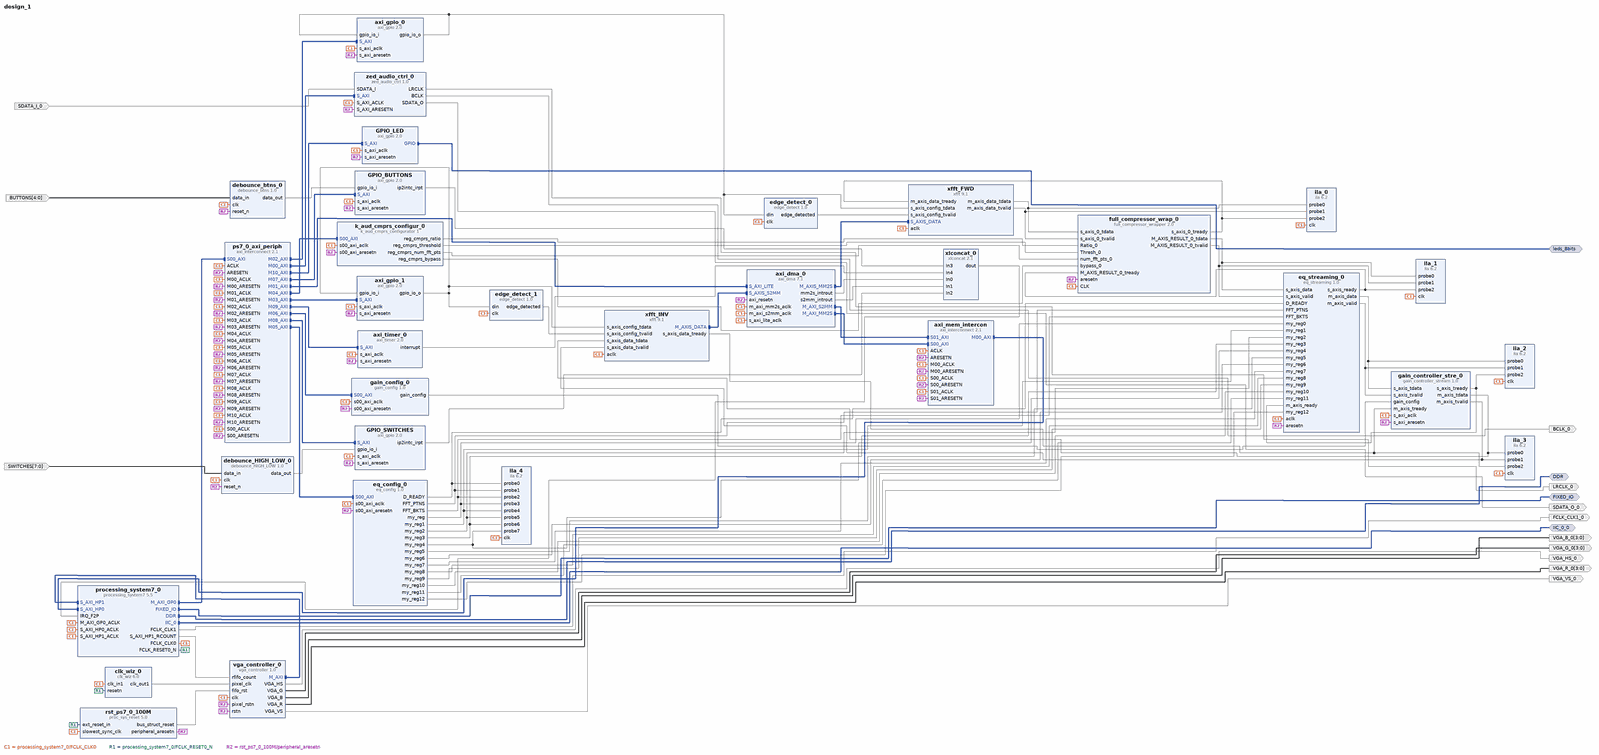
[diagram p0: block diagram of the top level, whole]
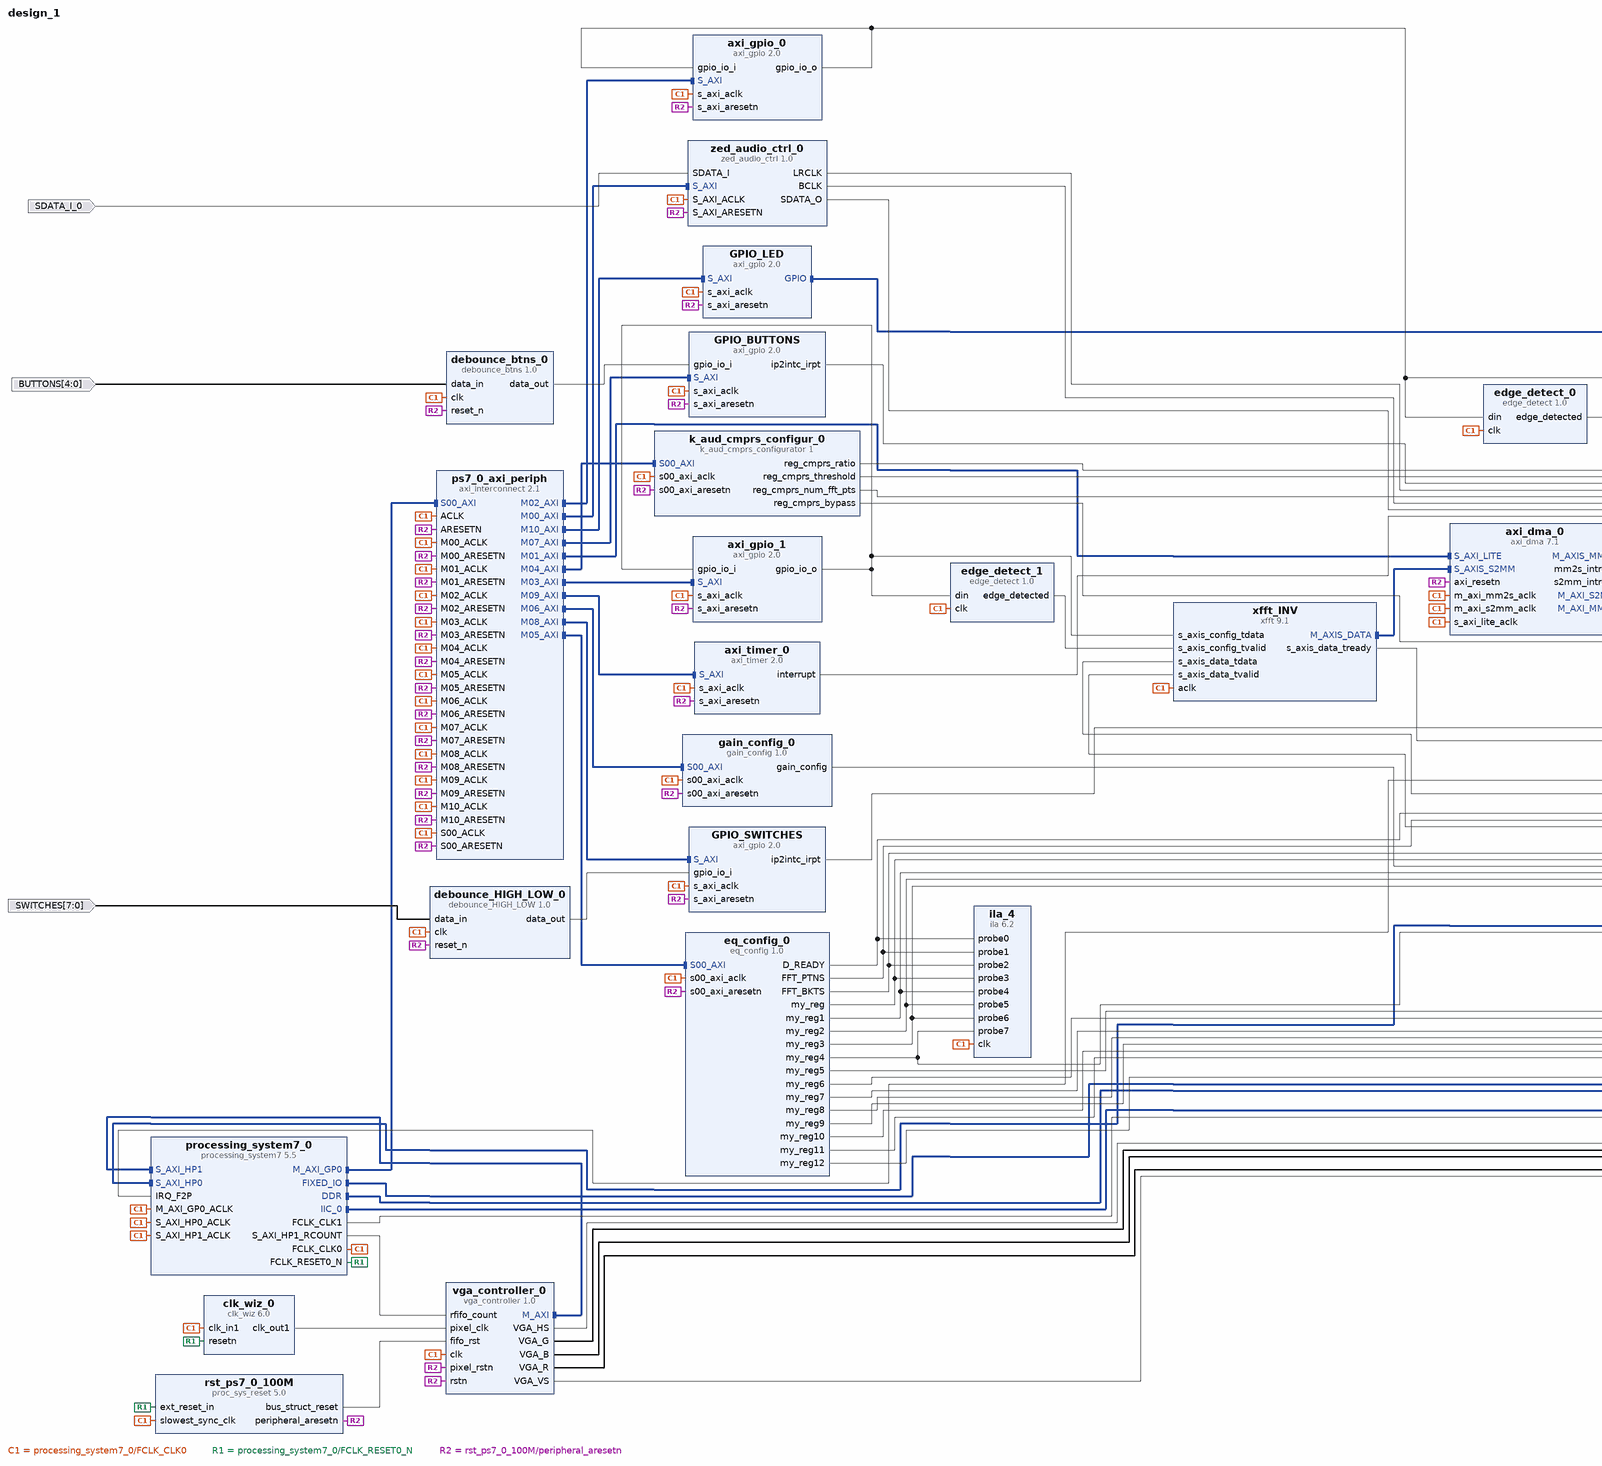
[diagram p1: block diagram of the top level, left part]
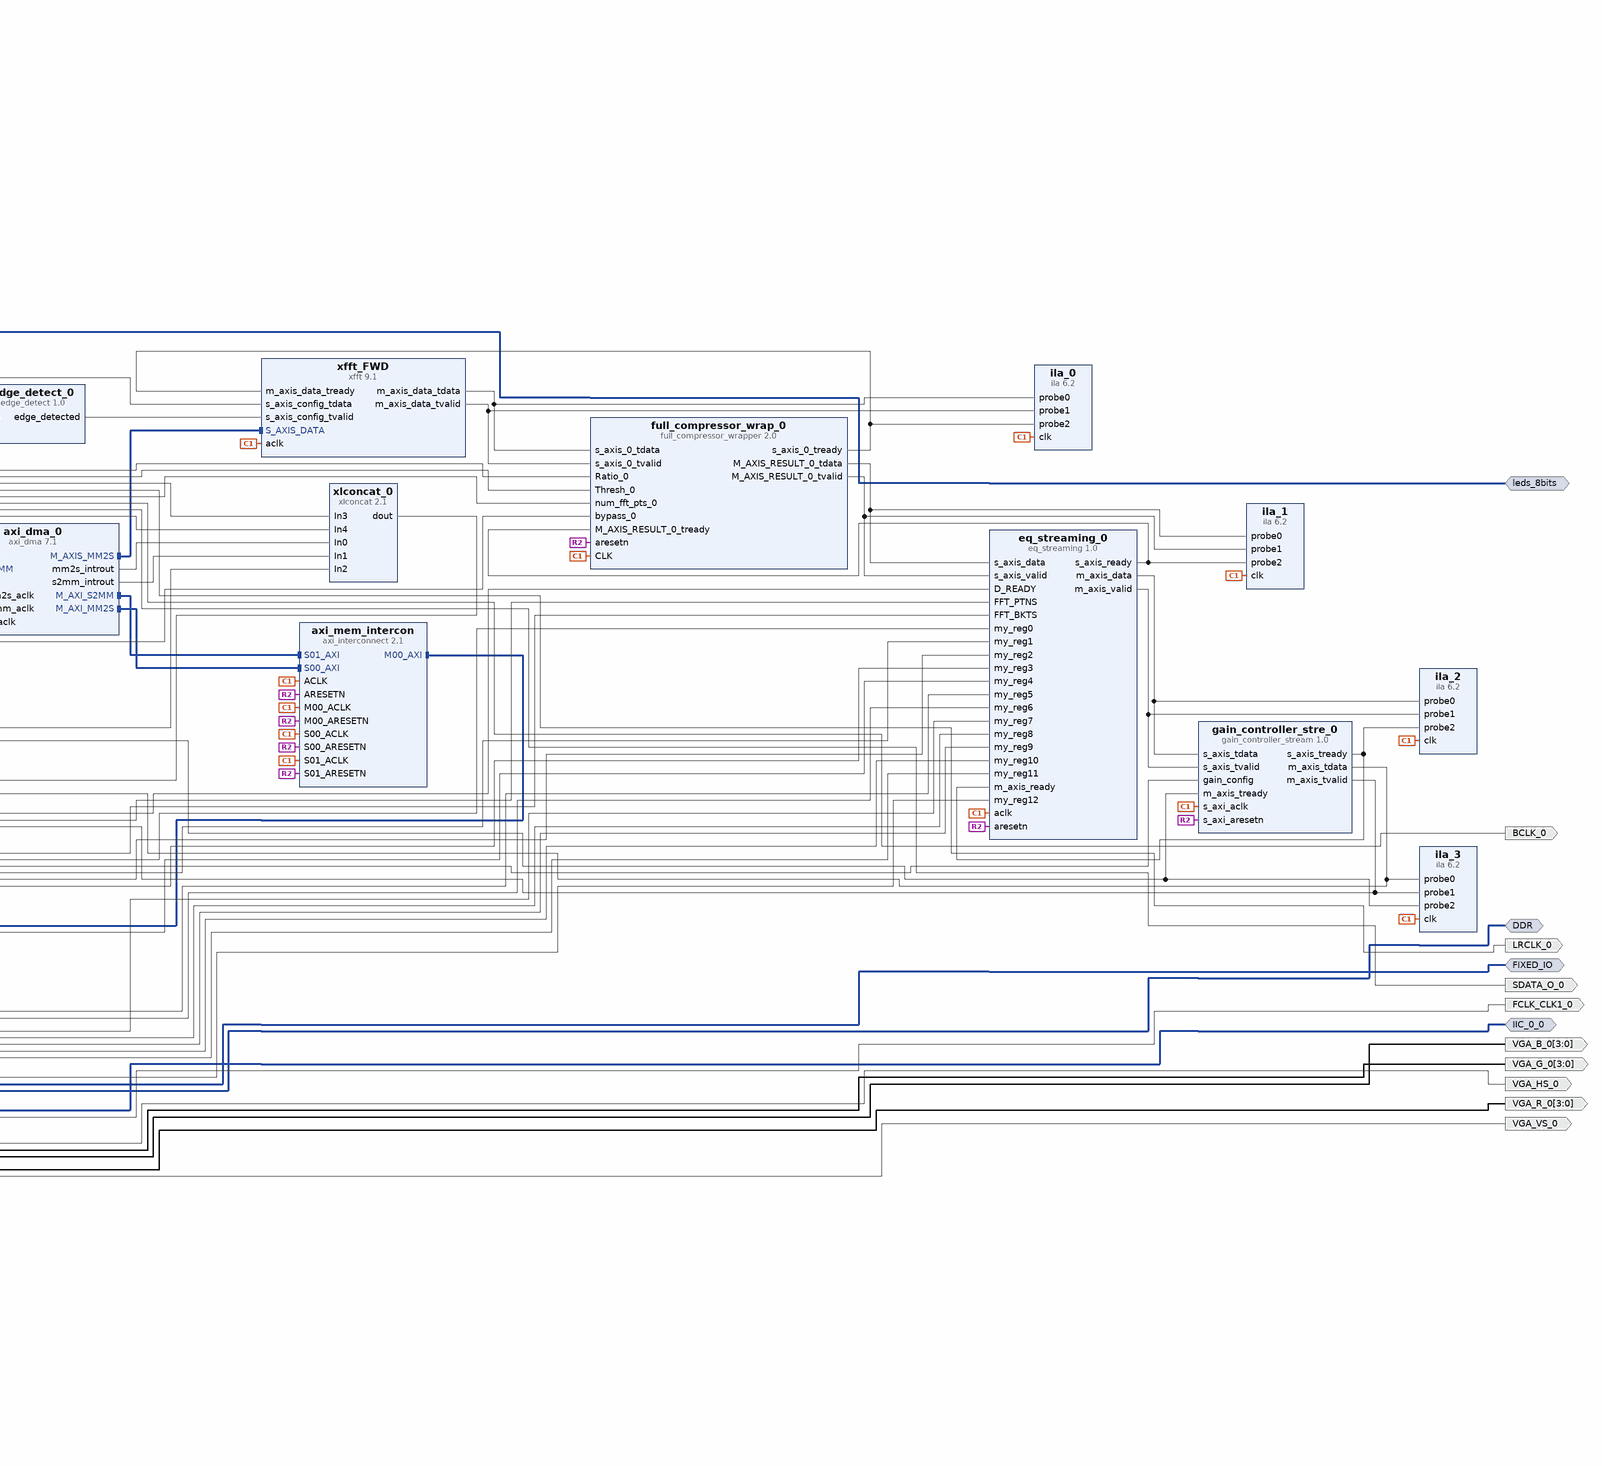
[diagram p2: block diagram of the top level, right part]
# Vivado block design design_1, xc7z020clg484-1, Vivado 2020.2
create_bd_design design_1

create_bd_intf_port -mode Master -vlnv xilinx.com:interface:ddrx_rtl:1.0 DDR
create_bd_intf_port -mode Master -vlnv xilinx.com:display_processing_system7:fixedio_rtl:1.0 FIXED_IO
create_bd_intf_port -mode Master -vlnv xilinx.com:interface:iic_rtl:1.0 IIC_0_0
create_bd_intf_port -mode Master -vlnv xilinx.com:interface:gpio_rtl:1.0 leds_8bits
create_bd_port -dir O -type clk FCLK_CLK1_0
set_property -dict {CONFIG.FREQ_HZ 10000000} [get_bd_ports FCLK_CLK1_0]
create_bd_port -dir O LRCLK_0
create_bd_port -dir O BCLK_0
create_bd_port -dir O SDATA_O_0
create_bd_port -dir I SDATA_I_0
create_bd_port -dir I -from 7 -to 0 SWITCHES
create_bd_port -dir I -from 4 -to 0 BUTTONS
create_bd_port -dir O VGA_HS_0
create_bd_port -dir O -from 3 -to 0 VGA_G_0
create_bd_port -dir O -from 3 -to 0 VGA_B_0
create_bd_port -dir O -from 3 -to 0 VGA_R_0
create_bd_port -dir O VGA_VS_0

create_bd_cell -type ip -vlnv xilinx.com:ip:processing_system7:5.5 processing_system7_0
set_property -dict [list \
  CONFIG.PCW_APU_PERIPHERAL_FREQMHZ 200 \
  CONFIG.PCW_ENET0_ENET0_IO {MIO 16 .. 27} \
  CONFIG.PCW_ENET0_GRP_MDIO_ENABLE 1 \
  CONFIG.PCW_ENET0_GRP_MDIO_IO {MIO 52 .. 53} \
  CONFIG.PCW_ENET0_PERIPHERAL_ENABLE 1 \
  CONFIG.PCW_ENET0_RESET_ENABLE 0 \
  CONFIG.PCW_ENET_RESET_ENABLE 1 \
  CONFIG.PCW_ENET_RESET_SELECT {Share reset pin} \
  CONFIG.PCW_EN_CLK1_PORT 1 \
  CONFIG.PCW_FCLK_CLK1_BUF TRUE \
  CONFIG.PCW_FPGA0_PERIPHERAL_FREQMHZ 100.000000 \
  CONFIG.PCW_FPGA1_PERIPHERAL_FREQMHZ 10 \
  CONFIG.PCW_FPGA2_PERIPHERAL_FREQMHZ 100 \
  CONFIG.PCW_FPGA_FCLK1_ENABLE 1 \
  CONFIG.PCW_GPIO_MIO_GPIO_ENABLE 1 \
  CONFIG.PCW_GPIO_MIO_GPIO_IO MIO \
  CONFIG.PCW_I2C0_I2C0_IO EMIO \
  CONFIG.PCW_I2C0_PERIPHERAL_ENABLE 1 \
  CONFIG.PCW_I2C_PERIPHERAL_FREQMHZ 33.333332 \
  CONFIG.PCW_I2C_RESET_ENABLE 1 \
  CONFIG.PCW_I2C_RESET_SELECT {Share reset pin} \
  CONFIG.PCW_IRQ_F2P_INTR 1 \
  CONFIG.PCW_PERIPHERAL_BOARD_PRESET part0 \
  CONFIG.PCW_PRESET_BANK1_VOLTAGE {LVCMOS 1.8V} \
  CONFIG.PCW_QSPI_GRP_SINGLE_SS_ENABLE 1 \
  CONFIG.PCW_QSPI_GRP_SINGLE_SS_IO {MIO 1 .. 6} \
  CONFIG.PCW_QSPI_PERIPHERAL_ENABLE 1 \
  CONFIG.PCW_QSPI_QSPI_IO {MIO 1 .. 6} \
  CONFIG.PCW_SD0_GRP_CD_ENABLE 1 \
  CONFIG.PCW_SD0_GRP_CD_IO {MIO 47} \
  CONFIG.PCW_SD0_GRP_WP_ENABLE 1 \
  CONFIG.PCW_SD0_GRP_WP_IO {MIO 46} \
  CONFIG.PCW_SD0_PERIPHERAL_ENABLE 1 \
  CONFIG.PCW_SD0_SD0_IO {MIO 40 .. 45} \
  CONFIG.PCW_SDIO_PERIPHERAL_FREQMHZ 50 \
  CONFIG.PCW_SINGLE_QSPI_DATA_MODE x4 \
  CONFIG.PCW_TTC0_PERIPHERAL_ENABLE 1 \
  CONFIG.PCW_TTC0_TTC0_IO EMIO \
  CONFIG.PCW_UART1_PERIPHERAL_ENABLE 1 \
  CONFIG.PCW_UART1_UART1_IO {MIO 48 .. 49} \
  CONFIG.PCW_UART_PERIPHERAL_FREQMHZ 50 \
  CONFIG.PCW_UIPARAM_DDR_FREQ_MHZ 533.333313 \
  CONFIG.PCW_UIPARAM_DDR_PARTNO {MT41J128M16 HA-15E} \
  CONFIG.PCW_USB0_PERIPHERAL_ENABLE 1 \
  CONFIG.PCW_USB0_RESET_ENABLE 0 \
  CONFIG.PCW_USB0_USB0_IO {MIO 28 .. 39} \
  CONFIG.PCW_USB_RESET_ENABLE 1 \
  CONFIG.PCW_USB_RESET_SELECT {Share reset pin} \
  CONFIG.PCW_USE_FABRIC_INTERRUPT 1 \
  CONFIG.PCW_USE_S_AXI_HP0 1 \
  CONFIG.PCW_USE_S_AXI_HP1 1 \
  CONFIG.preset ZedBoard \
] [get_bd_cells processing_system7_0]
# 515 more settings of processing_system7_0 are not shown: defaults, MIO pin electricals, DDR timing, and values the tool derives
create_bd_cell -type ip -vlnv xilinx.com:user:zed_audio_ctrl:1.0 zed_audio_ctrl_0
create_bd_cell -type ip -vlnv xilinx.com:ip:axi_interconnect:2.1 ps7_0_axi_periph
set_property -dict {CONFIG.NUM_MI 11 CONFIG.NUM_SI 1} [get_bd_cells ps7_0_axi_periph]
create_bd_cell -type ip -vlnv xilinx.com:ip:proc_sys_reset:5.0 rst_ps7_0_100M
create_bd_cell -type ip -vlnv xilinx.com:ip:xfft:9.1 xfft_FWD
set_property -dict [list \
  CONFIG.data_format fixed_point \
  CONFIG.implementation_options pipelined_streaming_io \
  CONFIG.input_width 16 \
  CONFIG.number_of_stages_using_block_ram_for_data_and_phase_factors 4 \
  CONFIG.output_ordering natural_order \
  CONFIG.run_time_configurable_transform_length true \
  CONFIG.target_clock_frequency 100 \
  CONFIG.transform_length 2048 \
] [get_bd_cells xfft_FWD]
create_bd_cell -type ip -vlnv xilinx.com:ip:xfft:9.1 xfft_INV
set_property -dict [list \
  CONFIG.data_format fixed_point \
  CONFIG.implementation_options pipelined_streaming_io \
  CONFIG.input_width 16 \
  CONFIG.number_of_stages_using_block_ram_for_data_and_phase_factors 4 \
  CONFIG.output_ordering natural_order \
  CONFIG.run_time_configurable_transform_length true \
  CONFIG.target_clock_frequency 100 \
  CONFIG.transform_length 2048 \
] [get_bd_cells xfft_INV]
create_bd_cell -type ip -vlnv xilinx.com:ip:axi_dma:7.1 axi_dma_0
set_property -dict [list \
  CONFIG.c_include_mm2s_dre 1 \
  CONFIG.c_include_s2mm_dre 1 \
  CONFIG.c_include_sg 0 \
  CONFIG.c_m_axi_mm2s_data_width 64 \
  CONFIG.c_m_axi_s2mm_data_width 64 \
  CONFIG.c_mm2s_burst_size 8 \
  CONFIG.c_s_axis_s2mm_tdata_width 32 \
  CONFIG.c_sg_length_width 26 \
] [get_bd_cells axi_dma_0]
create_bd_cell -type ip -vlnv xilinx.com:ip:axi_interconnect:2.1 axi_mem_intercon
set_property -dict {CONFIG.NUM_MI 1 CONFIG.NUM_SI 2} [get_bd_cells axi_mem_intercon]
create_bd_cell -type ip -vlnv xilinx.com:user:edge_detect:1.0 edge_detect_0
set_property -dict {CONFIG.N 24} [get_bd_cells edge_detect_0]
create_bd_cell -type ip -vlnv xilinx.com:ip:axi_gpio:2.0 axi_gpio_0
set_property -dict {CONFIG.C_GPIO_WIDTH 24} [get_bd_cells axi_gpio_0]
create_bd_cell -type ip -vlnv xilinx.com:user:edge_detect:1.0 edge_detect_1
set_property -dict {CONFIG.N 24} [get_bd_cells edge_detect_1]
create_bd_cell -type ip -vlnv xilinx.com:ip:axi_gpio:2.0 axi_gpio_1
set_property -dict {CONFIG.C_GPIO_WIDTH 24} [get_bd_cells axi_gpio_1]
create_bd_cell -type ip -vlnv xilinx.com:ip:xlconcat:2.1 xlconcat_0
set_property -dict {CONFIG.NUM_PORTS 5} [get_bd_cells xlconcat_0]
create_bd_cell -type ip -vlnv sfu.ca:user:eq_config:1.0 eq_config_0
create_bd_cell -type ip -vlnv sfu.ca:user:gain_config:1.0 gain_config_0
create_bd_cell -type ip -vlnv xilinx.com:ip:ila:6.2 ila_0
set_property -dict [list \
  CONFIG.C_DATA_DEPTH 8192 \
  CONFIG.C_ENABLE_ILA_AXI_MON false \
  CONFIG.C_MONITOR_TYPE Native \
  CONFIG.C_NUM_OF_PROBES 3 \
  CONFIG.C_PROBE0_WIDTH 32 \
] [get_bd_cells ila_0]
create_bd_cell -type ip -vlnv xilinx.com:ip:ila:6.2 ila_1
set_property -dict [list \
  CONFIG.C_DATA_DEPTH 8192 \
  CONFIG.C_ENABLE_ILA_AXI_MON false \
  CONFIG.C_MONITOR_TYPE Native \
  CONFIG.C_NUM_OF_PROBES 3 \
  CONFIG.C_PROBE0_WIDTH 32 \
] [get_bd_cells ila_1]
create_bd_cell -type ip -vlnv xilinx.com:ip:ila:6.2 ila_2
set_property -dict [list \
  CONFIG.C_DATA_DEPTH 8192 \
  CONFIG.C_ENABLE_ILA_AXI_MON false \
  CONFIG.C_MONITOR_TYPE Native \
  CONFIG.C_NUM_OF_PROBES 3 \
  CONFIG.C_PROBE0_WIDTH 32 \
] [get_bd_cells ila_2]
create_bd_cell -type ip -vlnv xilinx.com:ip:ila:6.2 ila_3
set_property -dict [list \
  CONFIG.C_DATA_DEPTH 8192 \
  CONFIG.C_ENABLE_ILA_AXI_MON false \
  CONFIG.C_MONITOR_TYPE Native \
  CONFIG.C_NUM_OF_PROBES 3 \
  CONFIG.C_PROBE0_WIDTH 32 \
] [get_bd_cells ila_3]
create_bd_cell -type ip -vlnv xilinx.com:ip:ila:6.2 ila_4
set_property -dict [list \
  CONFIG.C_DATA_DEPTH 8192 \
  CONFIG.C_ENABLE_ILA_AXI_MON false \
  CONFIG.C_MONITOR_TYPE Native \
  CONFIG.C_NUM_OF_PROBES 8 \
  CONFIG.C_PROBE0_WIDTH 32 \
  CONFIG.C_PROBE1_WIDTH 32 \
  CONFIG.C_PROBE2_WIDTH 32 \
  CONFIG.C_PROBE3_WIDTH 32 \
  CONFIG.C_PROBE4_WIDTH 32 \
  CONFIG.C_PROBE5_WIDTH 32 \
  CONFIG.C_PROBE6_WIDTH 32 \
  CONFIG.C_PROBE7_WIDTH 32 \
] [get_bd_cells ila_4]
create_bd_cell -type ip -vlnv xilinx.com:ip:axi_gpio:2.0 GPIO_BUTTONS
set_property -dict {CONFIG.C_ALL_INPUTS 1 CONFIG.C_GPIO_WIDTH 5 CONFIG.C_INTERRUPT_PRESENT 1} [get_bd_cells GPIO_BUTTONS]
create_bd_cell -type ip -vlnv xilinx.com:ip:axi_gpio:2.0 GPIO_SWITCHES
set_property -dict {CONFIG.C_ALL_INPUTS 1 CONFIG.C_GPIO_WIDTH 8 CONFIG.C_INTERRUPT_PRESENT 1} [get_bd_cells GPIO_SWITCHES]
create_bd_cell -type ip -vlnv sfu.ca:user:debounce_HIGH_LOW:1.0 debounce_HIGH_LOW_0
create_bd_cell -type ip -vlnv sfu.ca:user:debounce_btns:1.0 debounce_btns_0
create_bd_cell -type ip -vlnv xilinx.com:ip:axi_timer:2.0 axi_timer_0
set_property -dict {CONFIG.enable_timer2 0 CONFIG.mode_64bit 0} [get_bd_cells axi_timer_0]
create_bd_cell -type ip -vlnv user.org:user:vga_controller:1.0 vga_controller_0
set_property -dict [list \
  CONFIG.h_back_porch 88 \
  CONFIG.h_front_porch 40 \
  CONFIG.h_sync_polarity {"1"} \
  CONFIG.h_sync_pulse 128 \
  CONFIG.horizontal_length 800 \
  CONFIG.image_buffer1_baseaddr 0x10880000 \
  CONFIG.v_back_porch 23 \
  CONFIG.v_front_porch 1 \
  CONFIG.v_sync_polarity {"1"} \
  CONFIG.v_sync_pulse 4 \
  CONFIG.vertical_length 600 \
] [get_bd_cells vga_controller_0]
create_bd_cell -type ip -vlnv xilinx.com:ip:clk_wiz:6.0 clk_wiz_0
set_property -dict [list \
  CONFIG.CLKOUT1_JITTER 159.371 \
  CONFIG.CLKOUT1_REQUESTED_OUT_FREQ 40 \
  CONFIG.MMCM_CLKOUT0_DIVIDE_F 25.000 \
  CONFIG.RESET_PORT resetn \
  CONFIG.RESET_TYPE ACTIVE_LOW \
] [get_bd_cells clk_wiz_0]
create_bd_cell -type ip -vlnv xilinx.com:ip:axi_gpio:2.0 GPIO_LED
set_property -dict [list \
  CONFIG.C_DOUT_DEFAULT 0x000000a5 \
  CONFIG.GPIO_BOARD_INTERFACE leds_8bits \
  CONFIG.USE_BOARD_FLOW true \
] [get_bd_cells GPIO_LED]
create_bd_cell -type ip -vlnv sfu.ca:user:k_aud_cmprs_configurator:1 k_aud_cmprs_configur_0
create_bd_cell -type ip -vlnv sfu.ca:user:eq_streaming:1.0 eq_streaming_0
create_bd_cell -type ip -vlnv sfu.ca:user:full_compressor_wrapper:2.0 full_compressor_wrap_0
create_bd_cell -type ip -vlnv sfu.ca:user:gain_controller_stream:1.0 gain_controller_stre_0

# ---- connections ----

connect_bd_intf_net [get_bd_intf_pins ps7_0_axi_periph/M10_AXI] [get_bd_intf_pins GPIO_LED/S_AXI]
connect_bd_intf_net [get_bd_intf_pins ps7_0_axi_periph/M06_AXI] [get_bd_intf_pins gain_config_0/S00_AXI]
connect_bd_intf_net -intf_net axi_gpio_2_GPIO [get_bd_intf_ports leds_8bits] [get_bd_intf_pins GPIO_LED/GPIO]
connect_bd_intf_net [get_bd_intf_pins ps7_0_axi_periph/M08_AXI] [get_bd_intf_pins GPIO_SWITCHES/S_AXI]
connect_bd_intf_net [get_bd_intf_ports FIXED_IO] [get_bd_intf_pins processing_system7_0/FIXED_IO]
connect_bd_intf_net [get_bd_intf_pins ps7_0_axi_periph/M00_AXI] [get_bd_intf_pins zed_audio_ctrl_0/S_AXI]
connect_bd_intf_net [get_bd_intf_ports DDR] [get_bd_intf_pins processing_system7_0/DDR]
connect_bd_intf_net [get_bd_intf_pins ps7_0_axi_periph/M07_AXI] [get_bd_intf_pins GPIO_BUTTONS/S_AXI]
connect_bd_intf_net [get_bd_intf_pins ps7_0_axi_periph/M01_AXI] [get_bd_intf_pins axi_dma_0/S_AXI_LITE]
connect_bd_intf_net [get_bd_intf_pins ps7_0_axi_periph/M09_AXI] [get_bd_intf_pins axi_timer_0/S_AXI]
connect_bd_intf_net [get_bd_intf_pins processing_system7_0/S_AXI_HP1] [get_bd_intf_pins vga_controller_0/M_AXI]
connect_bd_intf_net [get_bd_intf_pins axi_dma_0/M_AXI_S2MM] [get_bd_intf_pins axi_mem_intercon/S01_AXI]
connect_bd_intf_net [get_bd_intf_pins axi_gpio_0/S_AXI] [get_bd_intf_pins ps7_0_axi_periph/M02_AXI]
connect_bd_intf_net [get_bd_intf_pins xfft_INV/M_AXIS_DATA] [get_bd_intf_pins axi_dma_0/S_AXIS_S2MM]
connect_bd_intf_net [get_bd_intf_pins axi_mem_intercon/M00_AXI] [get_bd_intf_pins processing_system7_0/S_AXI_HP0]
connect_bd_intf_net [get_bd_intf_pins processing_system7_0/M_AXI_GP0] [get_bd_intf_pins ps7_0_axi_periph/S00_AXI]
connect_bd_intf_net [get_bd_intf_pins ps7_0_axi_periph/M05_AXI] [get_bd_intf_pins eq_config_0/S00_AXI]
connect_bd_intf_net [get_bd_intf_pins axi_dma_0/M_AXIS_MM2S] [get_bd_intf_pins xfft_FWD/S_AXIS_DATA]
connect_bd_intf_net [get_bd_intf_ports IIC_0_0] [get_bd_intf_pins processing_system7_0/IIC_0]
connect_bd_intf_net [get_bd_intf_pins axi_gpio_1/S_AXI] [get_bd_intf_pins ps7_0_axi_periph/M03_AXI]
connect_bd_intf_net [get_bd_intf_pins ps7_0_axi_periph/M04_AXI] [get_bd_intf_pins k_aud_cmprs_configur_0/S00_AXI]
connect_bd_intf_net [get_bd_intf_pins axi_dma_0/M_AXI_MM2S] [get_bd_intf_pins axi_mem_intercon/S00_AXI]
connect_bd_net [get_bd_pins processing_system7_0/FCLK_CLK0] \
  [get_bd_pins processing_system7_0/M_AXI_GP0_ACLK] [get_bd_pins ps7_0_axi_periph/S00_ACLK] \
  [get_bd_pins rst_ps7_0_100M/slowest_sync_clk] [get_bd_pins ps7_0_axi_periph/M00_ACLK] [get_bd_pins ps7_0_axi_periph/ACLK] \
  [get_bd_pins axi_dma_0/s_axi_lite_aclk] [get_bd_pins ps7_0_axi_periph/M01_ACLK] [get_bd_pins axi_dma_0/m_axi_mm2s_aclk] \
  [get_bd_pins axi_mem_intercon/S00_ACLK] [get_bd_pins processing_system7_0/S_AXI_HP0_ACLK] \
  [get_bd_pins axi_mem_intercon/M00_ACLK] [get_bd_pins axi_mem_intercon/ACLK] [get_bd_pins axi_dma_0/m_axi_s2mm_aclk] \
  [get_bd_pins axi_mem_intercon/S01_ACLK] [get_bd_pins xfft_INV/aclk] [get_bd_pins xfft_FWD/aclk] \
  [get_bd_pins edge_detect_0/clk] [get_bd_pins edge_detect_1/clk] [get_bd_pins axi_gpio_0/s_axi_aclk] \
  [get_bd_pins axi_gpio_1/s_axi_aclk] [get_bd_pins ps7_0_axi_periph/M02_ACLK] [get_bd_pins ps7_0_axi_periph/M03_ACLK] \
  [get_bd_pins zed_audio_ctrl_0/S_AXI_ACLK] [get_bd_pins ps7_0_axi_periph/M04_ACLK] [get_bd_pins eq_config_0/s00_axi_aclk] \
  [get_bd_pins ps7_0_axi_periph/M05_ACLK] [get_bd_pins gain_config_0/s00_axi_aclk] [get_bd_pins ps7_0_axi_periph/M06_ACLK] \
  [get_bd_pins ila_0/clk] [get_bd_pins ila_1/clk] [get_bd_pins ila_2/clk] [get_bd_pins ila_3/clk] [get_bd_pins ila_4/clk] \
  [get_bd_pins debounce_btns_0/clk] [get_bd_pins debounce_HIGH_LOW_0/clk] [get_bd_pins GPIO_SWITCHES/s_axi_aclk] \
  [get_bd_pins GPIO_BUTTONS/s_axi_aclk] [get_bd_pins ps7_0_axi_periph/M07_ACLK] [get_bd_pins ps7_0_axi_periph/M08_ACLK] \
  [get_bd_pins axi_timer_0/s_axi_aclk] [get_bd_pins ps7_0_axi_periph/M09_ACLK] [get_bd_pins vga_controller_0/clk] \
  [get_bd_pins clk_wiz_0/clk_in1] [get_bd_pins processing_system7_0/S_AXI_HP1_ACLK] [get_bd_pins GPIO_LED/s_axi_aclk] \
  [get_bd_pins ps7_0_axi_periph/M10_ACLK] [get_bd_pins k_aud_cmprs_configur_0/s00_axi_aclk] [get_bd_pins eq_streaming_0/aclk] \
  [get_bd_pins full_compressor_wrap_0/CLK] [get_bd_pins gain_controller_stre_0/s_axi_aclk]
connect_bd_net [get_bd_pins processing_system7_0/FCLK_RESET0_N] [get_bd_pins rst_ps7_0_100M/ext_reset_in] [get_bd_pins clk_wiz_0/resetn]
connect_bd_net [get_bd_pins rst_ps7_0_100M/peripheral_aresetn] \
  [get_bd_pins ps7_0_axi_periph/S00_ARESETN] [get_bd_pins zed_audio_ctrl_0/S_AXI_ARESETN] \
  [get_bd_pins ps7_0_axi_periph/M00_ARESETN] [get_bd_pins ps7_0_axi_periph/ARESETN] [get_bd_pins axi_dma_0/axi_resetn] \
  [get_bd_pins ps7_0_axi_periph/M01_ARESETN] [get_bd_pins axi_mem_intercon/S00_ARESETN] \
  [get_bd_pins axi_mem_intercon/M00_ARESETN] [get_bd_pins axi_mem_intercon/ARESETN] \
  [get_bd_pins axi_mem_intercon/S01_ARESETN] [get_bd_pins axi_gpio_0/s_axi_aresetn] [get_bd_pins axi_gpio_1/s_axi_aresetn] \
  [get_bd_pins ps7_0_axi_periph/M03_ARESETN] [get_bd_pins ps7_0_axi_periph/M02_ARESETN] \
  [get_bd_pins ps7_0_axi_periph/M04_ARESETN] [get_bd_pins eq_config_0/s00_axi_aresetn] \
  [get_bd_pins ps7_0_axi_periph/M05_ARESETN] [get_bd_pins gain_config_0/s00_axi_aresetn] \
  [get_bd_pins ps7_0_axi_periph/M06_ARESETN] [get_bd_pins GPIO_BUTTONS/s_axi_aresetn] \
  [get_bd_pins ps7_0_axi_periph/M07_ARESETN] [get_bd_pins GPIO_SWITCHES/s_axi_aresetn] \
  [get_bd_pins ps7_0_axi_periph/M08_ARESETN] [get_bd_pins axi_timer_0/s_axi_aresetn] \
  [get_bd_pins ps7_0_axi_periph/M09_ARESETN] [get_bd_pins vga_controller_0/pixel_rstn] [get_bd_pins vga_controller_0/rstn] \
  [get_bd_pins debounce_btns_0/reset_n] [get_bd_pins debounce_HIGH_LOW_0/reset_n] [get_bd_pins GPIO_LED/s_axi_aresetn] \
  [get_bd_pins ps7_0_axi_periph/M10_ARESETN] [get_bd_pins k_aud_cmprs_configur_0/s00_axi_aresetn] \
  [get_bd_pins eq_streaming_0/aresetn] [get_bd_pins full_compressor_wrap_0/aresetn] \
  [get_bd_pins gain_controller_stre_0/s_axi_aresetn]
connect_bd_net [get_bd_pins processing_system7_0/FCLK_CLK1] [get_bd_ports FCLK_CLK1_0]
connect_bd_net [get_bd_pins axi_gpio_0/gpio_io_o] \
  [get_bd_pins axi_gpio_0/gpio_io_i] [get_bd_pins edge_detect_0/din] [get_bd_pins xfft_FWD/s_axis_config_tdata]
connect_bd_net [get_bd_pins edge_detect_0/edge_detected] [get_bd_pins xfft_FWD/s_axis_config_tvalid]
connect_bd_net [get_bd_pins axi_gpio_1/gpio_io_o] \
  [get_bd_pins axi_gpio_1/gpio_io_i] [get_bd_pins edge_detect_1/din] [get_bd_pins xfft_INV/s_axis_config_tdata]
connect_bd_net [get_bd_pins edge_detect_1/edge_detected] [get_bd_pins xfft_INV/s_axis_config_tvalid]
connect_bd_net [get_bd_pins axi_dma_0/mm2s_introut] [get_bd_pins xlconcat_0/In0]
connect_bd_net [get_bd_pins axi_dma_0/s2mm_introut] [get_bd_pins xlconcat_0/In1]
connect_bd_net [get_bd_pins xlconcat_0/dout] [get_bd_pins processing_system7_0/IRQ_F2P]
connect_bd_net [get_bd_pins zed_audio_ctrl_0/LRCLK] [get_bd_ports LRCLK_0]
connect_bd_net [get_bd_pins zed_audio_ctrl_0/BCLK] [get_bd_ports BCLK_0]
connect_bd_net [get_bd_pins zed_audio_ctrl_0/SDATA_O] [get_bd_ports SDATA_O_0]
connect_bd_net -net SDATA_I_0_1 [get_bd_ports SDATA_I_0] [get_bd_pins zed_audio_ctrl_0/SDATA_I]
connect_bd_net [get_bd_pins k_aud_cmprs_configur_0/reg_cmprs_ratio] [get_bd_pins full_compressor_wrap_0/Ratio_0]
connect_bd_net [get_bd_pins k_aud_cmprs_configur_0/reg_cmprs_threshold] [get_bd_pins full_compressor_wrap_0/Thresh_0]
connect_bd_net [get_bd_pins k_aud_cmprs_configur_0/reg_cmprs_num_fft_pts] [get_bd_pins full_compressor_wrap_0/num_fft_pts_0]
connect_bd_net [get_bd_pins k_aud_cmprs_configur_0/reg_cmprs_bypass] [get_bd_pins full_compressor_wrap_0/bypass_0]
connect_bd_net [get_bd_pins eq_config_0/D_READY] [get_bd_pins ila_4/probe0] [get_bd_pins eq_streaming_0/D_READY]
connect_bd_net [get_bd_pins eq_config_0/FFT_PTNS] [get_bd_pins ila_4/probe1] [get_bd_pins eq_streaming_0/FFT_PTNS]
connect_bd_net [get_bd_pins eq_config_0/FFT_BKTS] [get_bd_pins ila_4/probe2] [get_bd_pins eq_streaming_0/FFT_BKTS]
connect_bd_net [get_bd_pins eq_config_0/my_reg] [get_bd_pins ila_4/probe3] [get_bd_pins eq_streaming_0/my_reg0]
connect_bd_net [get_bd_pins eq_config_0/my_reg1] [get_bd_pins ila_4/probe4] [get_bd_pins eq_streaming_0/my_reg1]
connect_bd_net [get_bd_pins eq_config_0/my_reg2] [get_bd_pins ila_4/probe5] [get_bd_pins eq_streaming_0/my_reg2]
connect_bd_net [get_bd_pins eq_config_0/my_reg3] [get_bd_pins ila_4/probe6] [get_bd_pins eq_streaming_0/my_reg3]
connect_bd_net [get_bd_pins eq_config_0/my_reg4] [get_bd_pins ila_4/probe7] [get_bd_pins eq_streaming_0/my_reg4]
connect_bd_net [get_bd_pins eq_config_0/my_reg5] [get_bd_pins eq_streaming_0/my_reg5]
connect_bd_net [get_bd_pins eq_config_0/my_reg6] [get_bd_pins eq_streaming_0/my_reg6]
connect_bd_net [get_bd_pins eq_config_0/my_reg7] [get_bd_pins eq_streaming_0/my_reg7]
connect_bd_net [get_bd_pins eq_config_0/my_reg8] [get_bd_pins eq_streaming_0/my_reg8]
connect_bd_net [get_bd_pins eq_config_0/my_reg9] [get_bd_pins eq_streaming_0/my_reg9]
connect_bd_net [get_bd_pins eq_config_0/my_reg10] [get_bd_pins eq_streaming_0/my_reg10]
connect_bd_net [get_bd_pins eq_config_0/my_reg11] [get_bd_pins eq_streaming_0/my_reg11]
connect_bd_net [get_bd_pins eq_config_0/my_reg12] [get_bd_pins eq_streaming_0/my_reg12]
connect_bd_net [get_bd_pins gain_config_0/gain_config] [get_bd_pins gain_controller_stre_0/gain_config]
connect_bd_net [get_bd_pins xfft_FWD/m_axis_data_tdata] [get_bd_pins ila_0/probe0] [get_bd_pins full_compressor_wrap_0/s_axis_0_tdata]
connect_bd_net [get_bd_pins xfft_FWD/m_axis_data_tvalid] [get_bd_pins ila_0/probe1] [get_bd_pins full_compressor_wrap_0/s_axis_0_tvalid]
connect_bd_net [get_bd_pins full_compressor_wrap_0/s_axis_0_tready] [get_bd_pins xfft_FWD/m_axis_data_tready] [get_bd_pins ila_0/probe2]
connect_bd_net [get_bd_pins full_compressor_wrap_0/M_AXIS_RESULT_0_tdata] [get_bd_pins ila_1/probe0] [get_bd_pins eq_streaming_0/s_axis_data]
connect_bd_net [get_bd_pins full_compressor_wrap_0/M_AXIS_RESULT_0_tvalid] [get_bd_pins ila_1/probe1] [get_bd_pins eq_streaming_0/s_axis_valid]
connect_bd_net [get_bd_pins eq_streaming_0/s_axis_ready] [get_bd_pins ila_1/probe2] [get_bd_pins full_compressor_wrap_0/M_AXIS_RESULT_0_tready]
connect_bd_net [get_bd_pins eq_streaming_0/m_axis_data] [get_bd_pins ila_2/probe0] [get_bd_pins gain_controller_stre_0/s_axis_tdata]
connect_bd_net [get_bd_pins eq_streaming_0/m_axis_valid] [get_bd_pins ila_2/probe1] [get_bd_pins gain_controller_stre_0/s_axis_tvalid]
connect_bd_net [get_bd_pins gain_controller_stre_0/s_axis_tready] [get_bd_pins ila_2/probe2] [get_bd_pins eq_streaming_0/m_axis_ready]
connect_bd_net [get_bd_pins gain_controller_stre_0/m_axis_tdata] [get_bd_pins ila_3/probe0] [get_bd_pins xfft_INV/s_axis_data_tdata]
connect_bd_net [get_bd_pins gain_controller_stre_0/m_axis_tvalid] [get_bd_pins ila_3/probe1] [get_bd_pins xfft_INV/s_axis_data_tvalid]
connect_bd_net [get_bd_pins xfft_INV/s_axis_data_tready] [get_bd_pins ila_3/probe2] [get_bd_pins gain_controller_stre_0/m_axis_tready]
connect_bd_net [get_bd_pins debounce_HIGH_LOW_0/data_out] [get_bd_pins GPIO_SWITCHES/gpio_io_i]
connect_bd_net -net data_in_0_1 [get_bd_ports SWITCHES] [get_bd_pins debounce_HIGH_LOW_0/data_in]
connect_bd_net -net data_in_0_2 [get_bd_ports BUTTONS] [get_bd_pins debounce_btns_0/data_in]
connect_bd_net [get_bd_pins debounce_btns_0/data_out] [get_bd_pins GPIO_BUTTONS/gpio_io_i]
connect_bd_net [get_bd_pins GPIO_SWITCHES/ip2intc_irpt] [get_bd_pins xlconcat_0/In2]
connect_bd_net [get_bd_pins GPIO_BUTTONS/ip2intc_irpt] [get_bd_pins xlconcat_0/In3]
connect_bd_net [get_bd_pins axi_timer_0/interrupt] [get_bd_pins xlconcat_0/In4]
connect_bd_net [get_bd_pins clk_wiz_0/clk_out1] [get_bd_pins vga_controller_0/pixel_clk]
connect_bd_net [get_bd_pins rst_ps7_0_100M/bus_struct_reset] [get_bd_pins vga_controller_0/fifo_rst]
connect_bd_net [get_bd_pins processing_system7_0/S_AXI_HP1_RCOUNT] [get_bd_pins vga_controller_0/rfifo_count]
connect_bd_net [get_bd_pins vga_controller_0/VGA_HS] [get_bd_ports VGA_HS_0]
connect_bd_net [get_bd_pins vga_controller_0/VGA_G] [get_bd_ports VGA_G_0]
connect_bd_net [get_bd_pins vga_controller_0/VGA_B] [get_bd_ports VGA_B_0]
connect_bd_net [get_bd_pins vga_controller_0/VGA_R] [get_bd_ports VGA_R_0]
connect_bd_net [get_bd_pins vga_controller_0/VGA_VS] [get_bd_ports VGA_VS_0]

# ---- address map ----
assign_bd_address -offset 0x00000000 -range 512M -target_address_space [get_bd_addr_spaces axi_dma_0/Data_MM2S] [get_bd_addr_segs processing_system7_0/S_AXI_HP0/HP0_DDR_LOWOCM]
assign_bd_address -offset 0x00000000 -range 512M -target_address_space [get_bd_addr_spaces axi_dma_0/Data_S2MM] [get_bd_addr_segs processing_system7_0/S_AXI_HP0/HP0_DDR_LOWOCM]
assign_bd_address -offset 0x40400000 -range 64K -target_address_space [get_bd_addr_spaces processing_system7_0/Data] [get_bd_addr_segs axi_dma_0/S_AXI_LITE/Reg]
assign_bd_address -offset 0x41200000 -range 64K -target_address_space [get_bd_addr_spaces processing_system7_0/Data] [get_bd_addr_segs GPIO_BUTTONS/S_AXI/Reg]
assign_bd_address -offset 0x41210000 -range 64K -target_address_space [get_bd_addr_spaces processing_system7_0/Data] [get_bd_addr_segs GPIO_LED/S_AXI/Reg]
assign_bd_address -offset 0x41220000 -range 64K -target_address_space [get_bd_addr_spaces processing_system7_0/Data] [get_bd_addr_segs GPIO_SWITCHES/S_AXI/Reg]
assign_bd_address -offset 0x41230000 -range 64K -target_address_space [get_bd_addr_spaces processing_system7_0/Data] [get_bd_addr_segs axi_gpio_0/S_AXI/Reg]
assign_bd_address -offset 0x41240000 -range 64K -target_address_space [get_bd_addr_spaces processing_system7_0/Data] [get_bd_addr_segs axi_gpio_1/S_AXI/Reg]
assign_bd_address -offset 0x42800000 -range 64K -target_address_space [get_bd_addr_spaces processing_system7_0/Data] [get_bd_addr_segs axi_timer_0/S_AXI/Reg]
assign_bd_address -offset 0x43C00000 -range 64K -target_address_space [get_bd_addr_spaces processing_system7_0/Data] [get_bd_addr_segs eq_config_0/S00_AXI/S00_AXI_reg]
assign_bd_address -offset 0x43C10000 -range 64K -target_address_space [get_bd_addr_spaces processing_system7_0/Data] [get_bd_addr_segs gain_config_0/S00_AXI/S00_AXI_reg]
assign_bd_address -offset 0x43C20000 -range 64K -target_address_space [get_bd_addr_spaces processing_system7_0/Data] [get_bd_addr_segs k_aud_cmprs_configur_0/S00_AXI/S00_AXI_reg]
assign_bd_address -offset 0x43C30000 -range 64K -target_address_space [get_bd_addr_spaces processing_system7_0/Data] [get_bd_addr_segs zed_audio_ctrl_0/S_AXI/reg0]
assign_bd_address -offset 0x00000000 -range 512M -target_address_space [get_bd_addr_spaces vga_controller_0/M_AXI] [get_bd_addr_segs processing_system7_0/S_AXI_HP1/HP1_DDR_LOWOCM]

validate_bd_design
save_bd_design
